# Altium schematic sheet Power_Switch.SchDoc
size A1
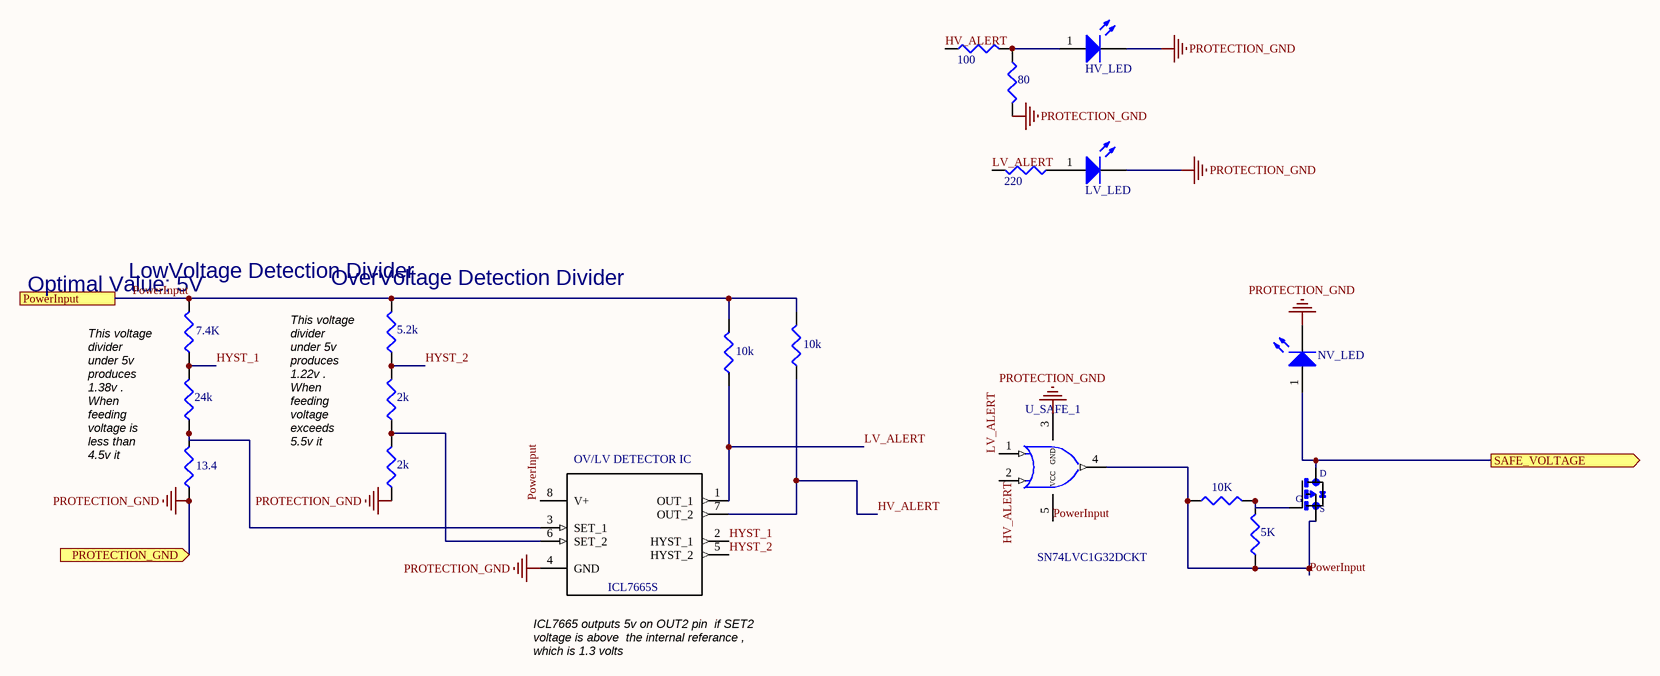
[diagram p0: Power_Switch.SchDoc]

## Parts
HV_LED  L_green  [LED_0603]  (value not drawn)
LV_LED  L_green  [LED_0603]  (value not drawn)
MOS_SAFE_1  SI2323DS-T1-GE3  [*SOT23]  (value not drawn)
NV_LED  L_green  [LED_0603]  (value not drawn)
OV/LV_DETECTOR_IC  ICL7665S  [*SOIC127P600X175-8N]
R_SAFE_10  value 10K  [1608(0603)]  (hidden comment: Res3)
R_SAFE_11  value 5K  [1608(0603)]  (hidden comment: Res3)
RHV1  value 5.2k  [1608(0603)]  (hidden comment: Res3)
RHV2  value 2k  [1608(0603)]  (hidden comment: Res3)
RHV3  value 2k  [1608(0603)]  (hidden comment: Res3)
RHV_ALERT1  value 100  [1608(0603)]  (hidden comment: Res3)
RHV_ALERT2  value 80  [1608(0603)]  (hidden comment: Res3)
RICL_OUT2  value 10k  [1608(0603)]  (hidden comment: Res3)
RICLOUT1  value 10k  [1608(0603)]  (hidden comment: Res3)
RLV1  value 7.4K  [1608(0603)]  (hidden comment: Res3)
RLV2  value 24k  [1608(0603)]  (hidden comment: Res3)
RLV3  value 13.4  [1608(0603)]  (hidden comment: Res3)
RLV_ALERT1  value 220  [1608(0603)]  (hidden comment: Res3)
U_SAFE_1  SN74LVC1G32DCKT  [*SOT65P210X110-5N]

## Ports
PowerInput, PROTECTION_GND (in), SAFE_VOLTAGE (out)

## Nets
PROTECTION_GND: HV_LED.2(K) LV_LED.2(K) NV_LED.2(K) OV/LV_DETECTOR_IC.4(GND) RHV3.1 RHV_ALERT2.2 RLV3.1 U_SAFE_1.3(GND) ; port PROTECTION_GND
HV_ALERT: OV/LV_DETECTOR_IC.7(OUT_2) RHV_ALERT1.1 RICL_OUT2.1 U_SAFE_1.2
HYST_1: OV/LV_DETECTOR_IC.2(HYST_1) RLV1.1 RLV2.2
HYST_2: OV/LV_DETECTOR_IC.5(HYST_2) RHV1.1 RHV2.2
LV_ALERT: OV/LV_DETECTOR_IC.1(OUT_1) RICLOUT1.1 RLV_ALERT1.2 U_SAFE_1.1(A)
PowerInput: MOS_SAFE_1.2(S) OV/LV_DETECTOR_IC.8(V+) R_SAFE_10.1 R_SAFE_11.1 RHV1.2 RICL_OUT2.2 RICLOUT1.2 RLV1.2 U_SAFE_1.4(Y) U_SAFE_1.5(VCC) ; port PowerInput
SAFE_VOLTAGE: MOS_SAFE_1.3(D) NV_LED.1(V) ; port SAFE_VOLTAGE
NetHV_LED_1: HV_LED.1(V) RHV_ALERT1.2 RHV_ALERT2.1
NetLV_LED_1: LV_LED.1(V) RLV_ALERT1.1
NetMOS_SAFE_1_1: MOS_SAFE_1.1(G) R_SAFE_10.2 R_SAFE_11.2
NetOV/LV_DETECTOR_IC_3: OV/LV_DETECTOR_IC.3(SET_1) RLV2.1 RLV3.2
NetOV/LV_DETECTOR_IC_6: OV/LV_DETECTOR_IC.6(SET_2) RHV2.1 RHV3.2

## Notes on the sheet
- (near RLV1) Optimal Value: 5V
- LowVoltage Detection Divider
- (near RHV1) OverVoltage Detection Divider
- This voltage divider under 5v produces 1.38v .          When feeding voltage is less than 4.5v it produces 1.25v
- This voltage divider under 5v produces 1.22v .          When feeding voltage exceeds 5.5v it produces 1.35v.
- (near OV/LV_DETECTOR_IC) ICL7665 outputs 5v on OUT2 pin  if SET2 voltage is above  the internal referance , which is 1.3 volts

## Library data of the parts
MOS_SAFE_1 = PMOS: Single P-Channel 20 V 0.039 O 19 nC Surface Mount Power Mosfet - SOT-23; MF: Vishay; MP: SI2323DS-T1-GE3; Availability: Unavailable; SnapEDA_Link: https://www.snapeda.com/parts/SI2323DS-T1-GE3/Vishay%20Siliconix/view-part/?ref=snap; Package: SOT-23-3 Vishay; Price: None; Value: *
OV/LV_DETECTOR_IC = ICL7665SCBAZA-T: CMOS Micropower Over/Under Voltage Detector; MF: Renesas Electronics; Package: SOIC-8 Intersil; Digi-Key_Purchase_URL: https://www.digikey.com.tr/product-detail/en/renesas-electronics-america-inc/ICL7665SCBAZA-T/ICL7665SCBAZA-TTR-ND/1034561?utm_source=snapeda&utm_medium=aggregator&utm_campaign=symbol; MP: ICL7665SCBAZA-T; Digi-Key_Part_Number: ICL7665SCBAZA-TTR-ND; SnapEDA_Link: https://www.snapeda.com/parts/ICL7665SCBAZA-T/Renesas%20Electronics%20America%20Inc./view-part/?ref=snap; Value: *
R_SAFE_10 R_SAFE_11 RHV1-RHV3 RHV_ALERT1 RHV_ALERT2 RICL_OUT2 RICLOUT1 RLV1-RLV3 RLV_ALERT1 = Res3: Resistor; Published: 8-Jun-2000; LatestRevisionDate: 29-May-2009; LatestRevisionNote: IPC-7351 Footprint Added.; PackageReference: J1-0603; Publisher: Altium Limited; PackageDescription: Chip Resistor
U_SAFE_1 = SN74LVC1: Single 2-Input Positive-O Gate 5-SC70 -40 to 125; MF: Texas Instruments; SnapEDA_Link: https://www.snapeda.com/parts/SN74LVC1G32DCKT/Texas%20Instruments/view-part/?ref=snap; Price: None; Package: SC-70-5 Texas Instruments; Availability: Unavailable; MP: SN74LVC1G32DCKT; Value: *